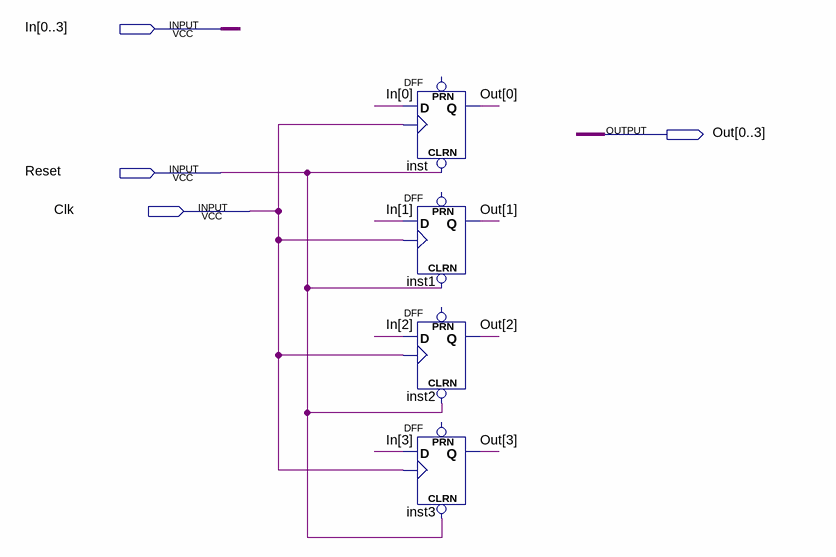
[diagram p0: schematic sheet]
// Quartus schematic Reg_4bit.bdf as structural Verilog: 4 symbols, 4 pins
module Reg_4bit (
  input  [0:3] In,
  input  Reset,
  input  Clk,
  output [0:3] Out
);

  DFF inst (.CLRN(Reset), .CLK(Clk), .D(In[0]), .Q(Out[0]));  // open: PRN
  DFF inst1 (.CLRN(Reset), .CLK(Clk), .D(In[1]), .Q(Out[1]));  // open: PRN
  DFF inst2 (.CLRN(Reset), .CLK(Clk), .D(In[2]), .Q(Out[2]));  // open: PRN
  DFF inst3 (.CLRN(Reset), .CLK(Clk), .D(In[3]), .Q(Out[3]));  // open: PRN
endmodule
